# Altium schematic sheet ETAPA DE POTENCIA CERROJO.SchDoc: Entrada de Potencia
size A4; Revision: 1.0; SheetNumber: 1; SheetTotal: 1; DocumentName: ETAPA DE POTENCIA
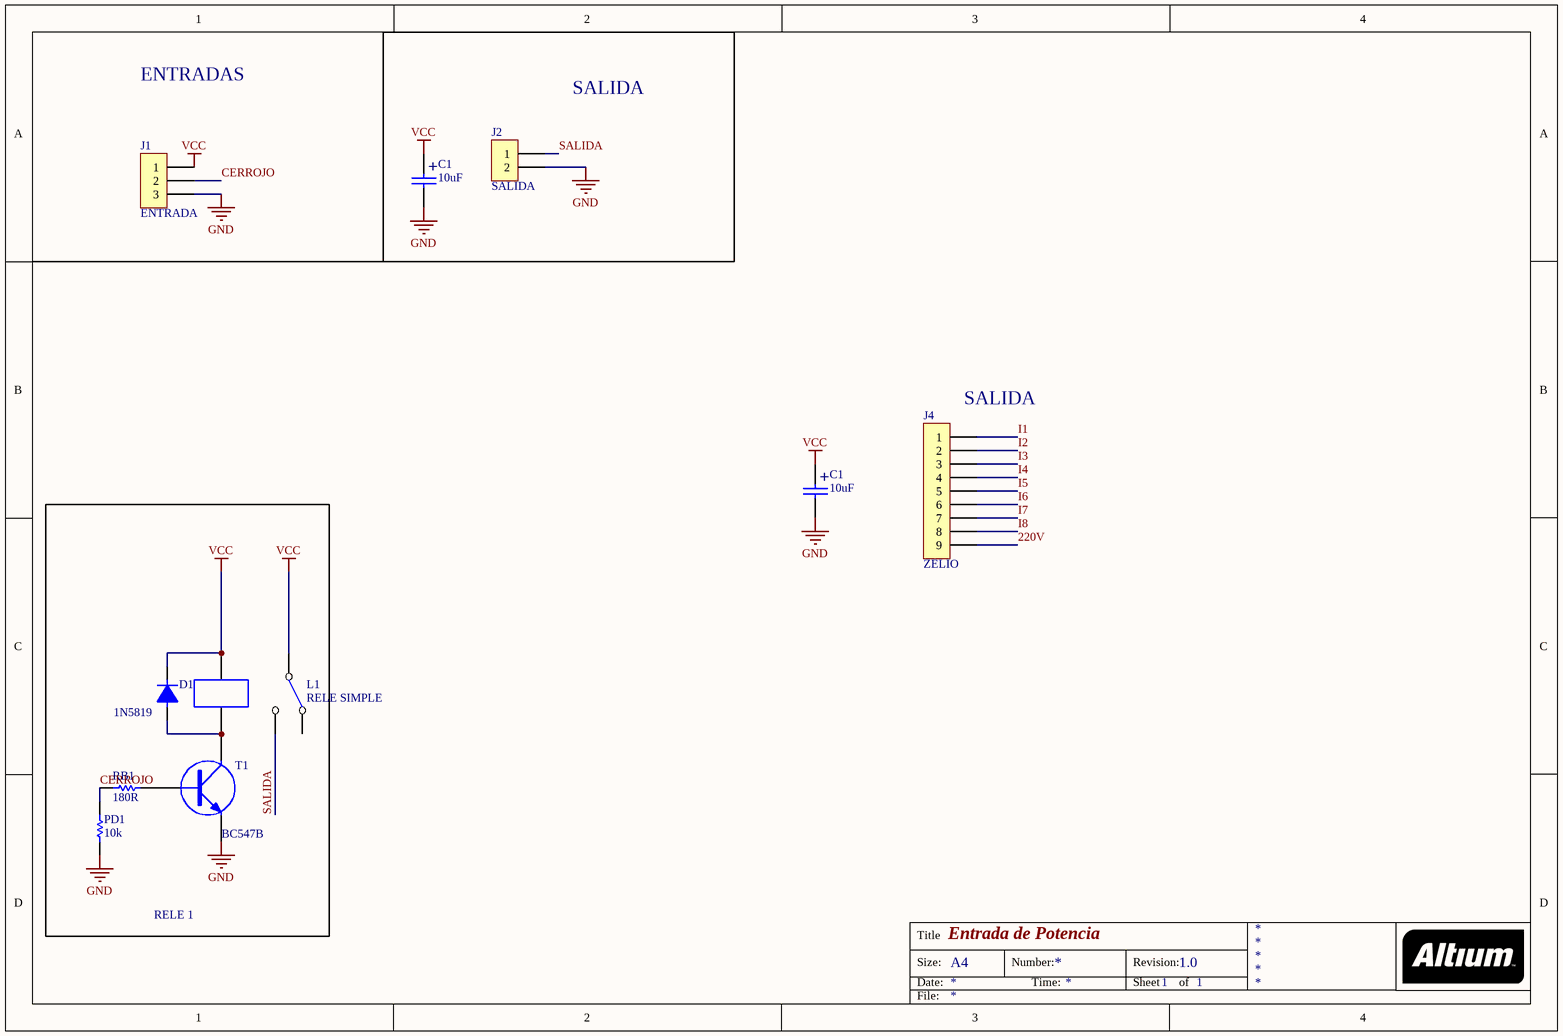
[diagram p0: ETAPA DE POTENCIA CERROJO.SchDoc]

## Parts
(Parts that share a designator on the sheet are numbered #1, #2 ... from top to bottom, then left to right.)
C1#1  10uF  [CAP100RP]
C1#2  10uF  [CAP100RP]
D1  1N5819  [DO41]
J1  ENTRADA  [BORNERA3]
J2  SALIDA  [BORNERA2]
J4  ZELIO  [BORNERA9]
L1  RELE SIMPLE  [RELE SERIE 964]
PD1  10k  [RES400]
RB1  180R  [RES400]
T1  BC547B  [TO92]

## Blocks framed on the sheet
RELE 1: D1 L1 PD1 RB1 T1

## Nets
GND: C1#1.2 C1#2.2 J1.3 J2.2 PD1.1 T1.3(E)
VCC: C1#1.1 C1#2.1 D1.2 J1.1 L1.B2 L1.C1
220V: J4.9
CERROJO: J1.2 PD1.2 RB1.1
I1: J4.1
I2: J4.2
I3: J4.3
I4: J4.4
I5: J4.5
I6: J4.6
I7: J4.7
I8: J4.8
SALIDA: J2.1 L1.NA1
NetD1_1: D1.1 L1.B1 T1.2(C)
NetRB1_2: RB1.2 T1.1(B)

Not connected (* = marked no-connect by the designer): L1 NC1

## Notes on the sheet
- ENTRADAS
- SALIDA
- (near J4) SALIDA
- Title
- Size:
- Date:
- A4
- Number:
- Time:
- Revision:
- Sheet
- of
- File:
- (in symbol CAPPOL) +

## Library data of the parts
C1#1 C1#2 = CAPPOL
D1 = DIODO
J1 = BORNERA 3
J2 = BORNERA 2
J4 = BORNERA 9
PD1 RB1 = RES
T1 = TRANSISTOR NPN